# Altium project JacdacEc30Hub10x40 114.PrjPCB
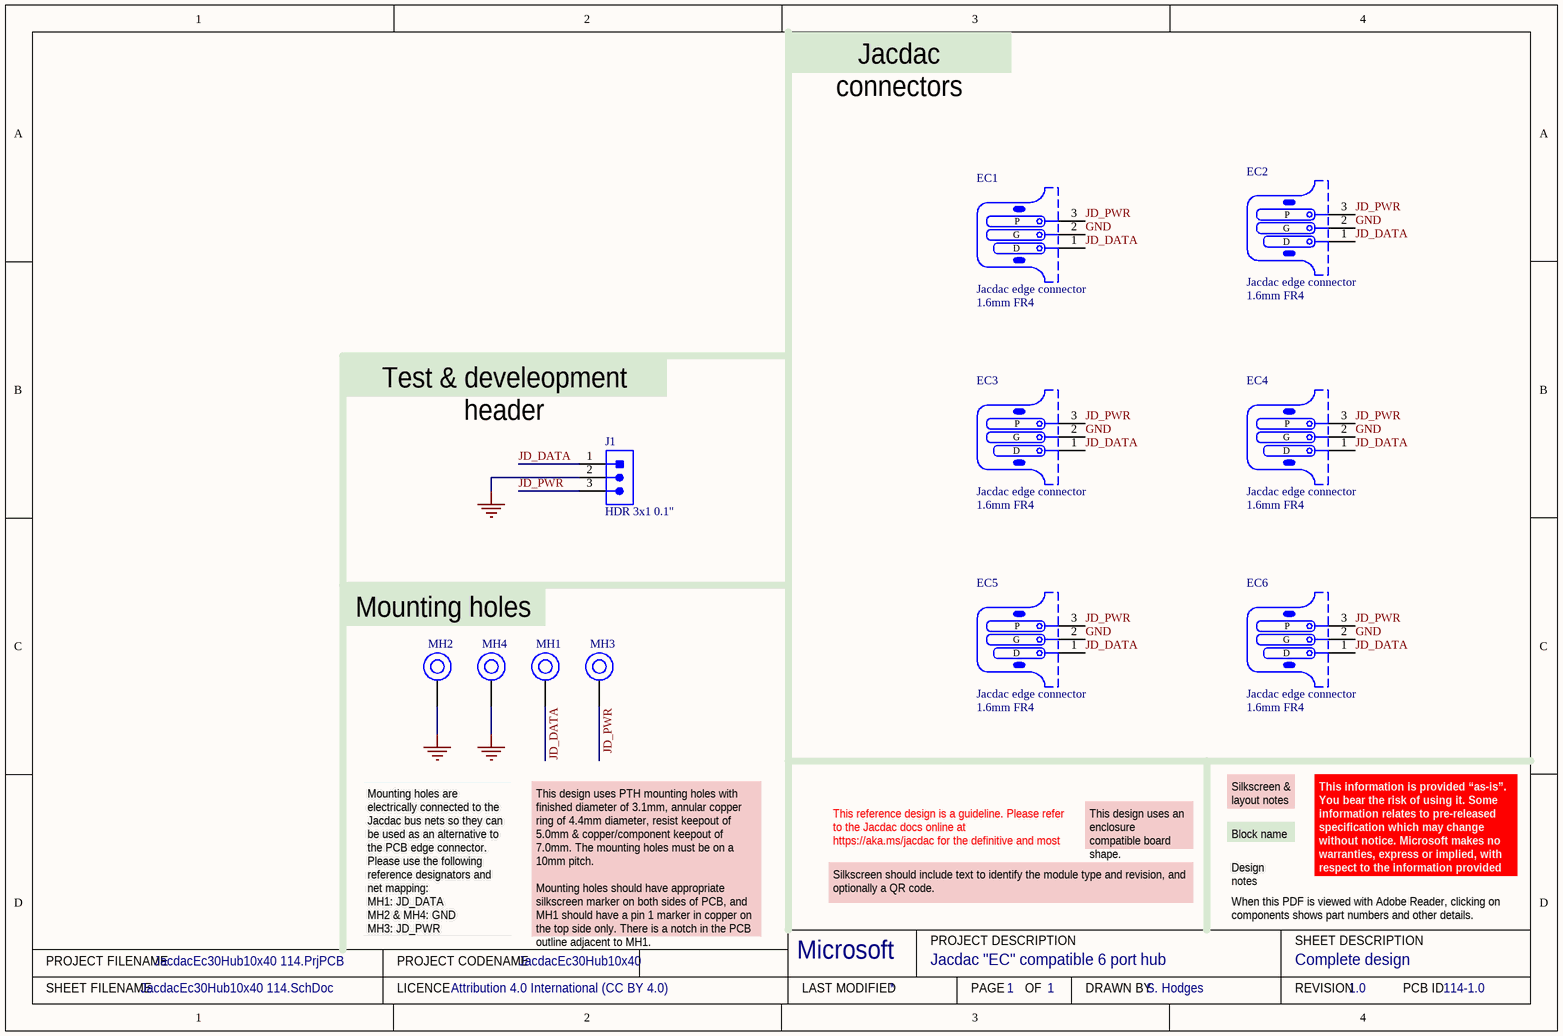
[diagram p0: JacdacEc30Hub10x40 114.SchDoc]
ProjectRevision: 1.0; ProjectLicenceTerms: Attribution 4.0 International (CC BY 4.0); ProjectDrawnBy: S. Hodges; ProjectCodenameID: 114; ProjectCodenameDescription: Jacdac "EC" compatible 6 port hub; ProjectCodeName: JacdacEc30Hub10x40
1 sheet, 11 parts. Net scope: global (net labels, ports and power ports of the same name join across sheets).
Board file: JacdacEc30Hub10x40 114.PcbDoc

## Sheet JacdacEc30Hub10x40 114.SchDoc: Complete design
size A4; DrawnBy: S. Hodges; DocumentNumber: 1; Revision: 1.0; SheetNumber: 1; SheetTotal: 1; VersionControl_RevNumber: 1

### Parts
EC1  Jacdac edge connector  PCB Type: 1.6mm FR4  [JACDAC_EDGE_CONNECTOR_TRACES_0.15MM]  (no BOM)
EC2  Jacdac edge connector  PCB Type: 1.6mm FR4  [JACDAC_EDGE_CONNECTOR_TRACES_0.15MM]  (no BOM)
EC3  Jacdac edge connector  PCB Type: 1.6mm FR4  [JACDAC_EDGE_CONNECTOR_TRACES_0.15MM]  (no BOM)
EC4  Jacdac edge connector  PCB Type: 1.6mm FR4  [JACDAC_EDGE_CONNECTOR_TRACES_0.15MM]  (no BOM)
EC5  Jacdac edge connector  PCB Type: 1.6mm FR4  [JACDAC_EDGE_CONNECTOR_TRACES_0.15MM]  (no BOM)
EC6  Jacdac edge connector  PCB Type: 1.6mm FR4  [JACDAC_EDGE_CONNECTOR_TRACES_0.15MM]  (no BOM)
J1  HDR 3x1 0.1"  [Generic 1x3 2.54mm header]  (no BOM)
MH1  MH_6.5MMK_4.5MMC_3.0MMD_PTH  [MH_6.5MMK_4.5MMC_3.0MMD_PTH]  (value not drawn)  (no BOM)
MH2  MH_6.5MMK_4.5MMC_3.0MMD_PTH  [MH_6.5MMK_4.5MMC_3.0MMD_PTH]  (value not drawn)  (no BOM)
MH3  MH_6.5MMK_4.5MMC_3.0MMD_PTH  [MH_6.5MMK_4.5MMC_3.0MMD_PTH]  (value not drawn)  (no BOM)
MH4  MH_6.5MMK_4.5MMC_3.0MMD_PTH  [MH_6.5MMK_4.5MMC_3.0MMD_PTH]  (value not drawn)  (no BOM)

### Nets
GND: EC1.2(G) EC2.2(G) EC3.2(G) EC4.2(G) EC5.2(G) EC6.2(G) J1.2 MH2.1 MH4.1
JD_DATA: EC1.1(D) EC2.1(D) EC3.1(D) EC4.1(D) EC5.1(D) EC6.1(D) J1.1 MH1.1
JD_PWR: EC1.3(P) EC2.3(P) EC3.3(P) EC4.3(P) EC5.3(P) EC6.3(P) J1.3 MH3.1

### Notes on the sheet
- Jacdac connectors
- Test & develeopment header
- Mounting holes
- This reference design is a guideline. Please refer to the Jacdac docs online at https://aka.ms/jacdac for the definitive and most up-to-date information.
- This design uses an enclosure compatible board shape.
- Block name
- Silkscreen & layout notes
- Mounting holes are electrically connected to the Jacdac bus nets so they can be used as an alternative to the PCB edge connector. Please use the following reference designators and net mapping:
- Silkscreen should include text to identify the module type and revision, and optionally a QR code.
- Design notes
- When this PDF is viewed with Adobe Reader, clicking on components shows part numbers and other details.
- This information is provided “as-is”. You bear the risk of using it. Some information relates to pre-released specification which may change without notice. Microsoft makes no warranties, express or implied, with respect to the information provided here.
- MH1: JD_DATA
  MH2 & MH4: GND
  MH3: JD_PWR
- This design uses PTH mounting holes with finished diameter of 3.1mm, annular copper ring of 4.4mm diameter, resist keepout of 5.0mm & copper/component keepout of 7.0mm. The mounting holes must be on a 10mm pitch.
  Mounting holes should have appropriate silkscreen marker on both sides of PCB, and MH1 should have a pin 1 marker in copper on the top side only. There is a notch in the PCB outline adjacent to MH1.
- PROJECT FILENAME
- PROJECT CODENAME
- Microsoft
- PROJECT DESCRIPTION
- SHEET DESCRIPTION
- SHEET FILENAME
- LICENCE
- LAST MODIFIED
- PAGE
- OF
- DRAWN BY
- REVISION
- PCB ID

### Library data of the parts
EC1-EC6 = Jacdac edge connector: 3 pin Jacdac edge connector 1.27mm pitch; Created By: D. Gakure & S. Hodges; Manufacturer Part Number: n/a; ComponentLink1Description: Yuliang JACDAC cable connector drawing online; ComponentLink1URL: https://github.com/microsoft/jacdac-ddk/tree/main/connector; ComponentLink2Description: JACDAC PCB edge connector spec onlin; ComponentLink2URL: https://github.com/microsoft/jacdac-ddk/tree/main/connector
J1 = Header Multicomp 2211S-03G-whitesch: 2.54mm, 3x1 way, vertical, square pin, gold plate; Created By: daclethe; Supplier 1: Farnell; Manufacturer: Multicomp; Manufacturer Part Number: 2211S-03G; RoHS: YES; Stock 1: 12851; Pricing 1: 50=0.0701, 100=0.0588, 500=0.0421, 1000=0.0289, 2000=0.0262, 6000=0.0238, 20000=0.0206 (GBP); ComponentLink1URL: http://www.farnell.com/datasheets/1518407.pdf; ComponentLink1Description: header strip datasheet; Supplier Part Number 1: 1593412
MH1-MH4 = MH_6.5MMK_4.5MMC_3.0MMD_PTH: Mounting Hole 6.5mm keepout, 4.5mm annualar ring and 3.0mm Drill PTH